# Altium project WUT-4-3-3.PrjPCB (part 2 of 2)

## Sheet MCU.SchDoc
size A3
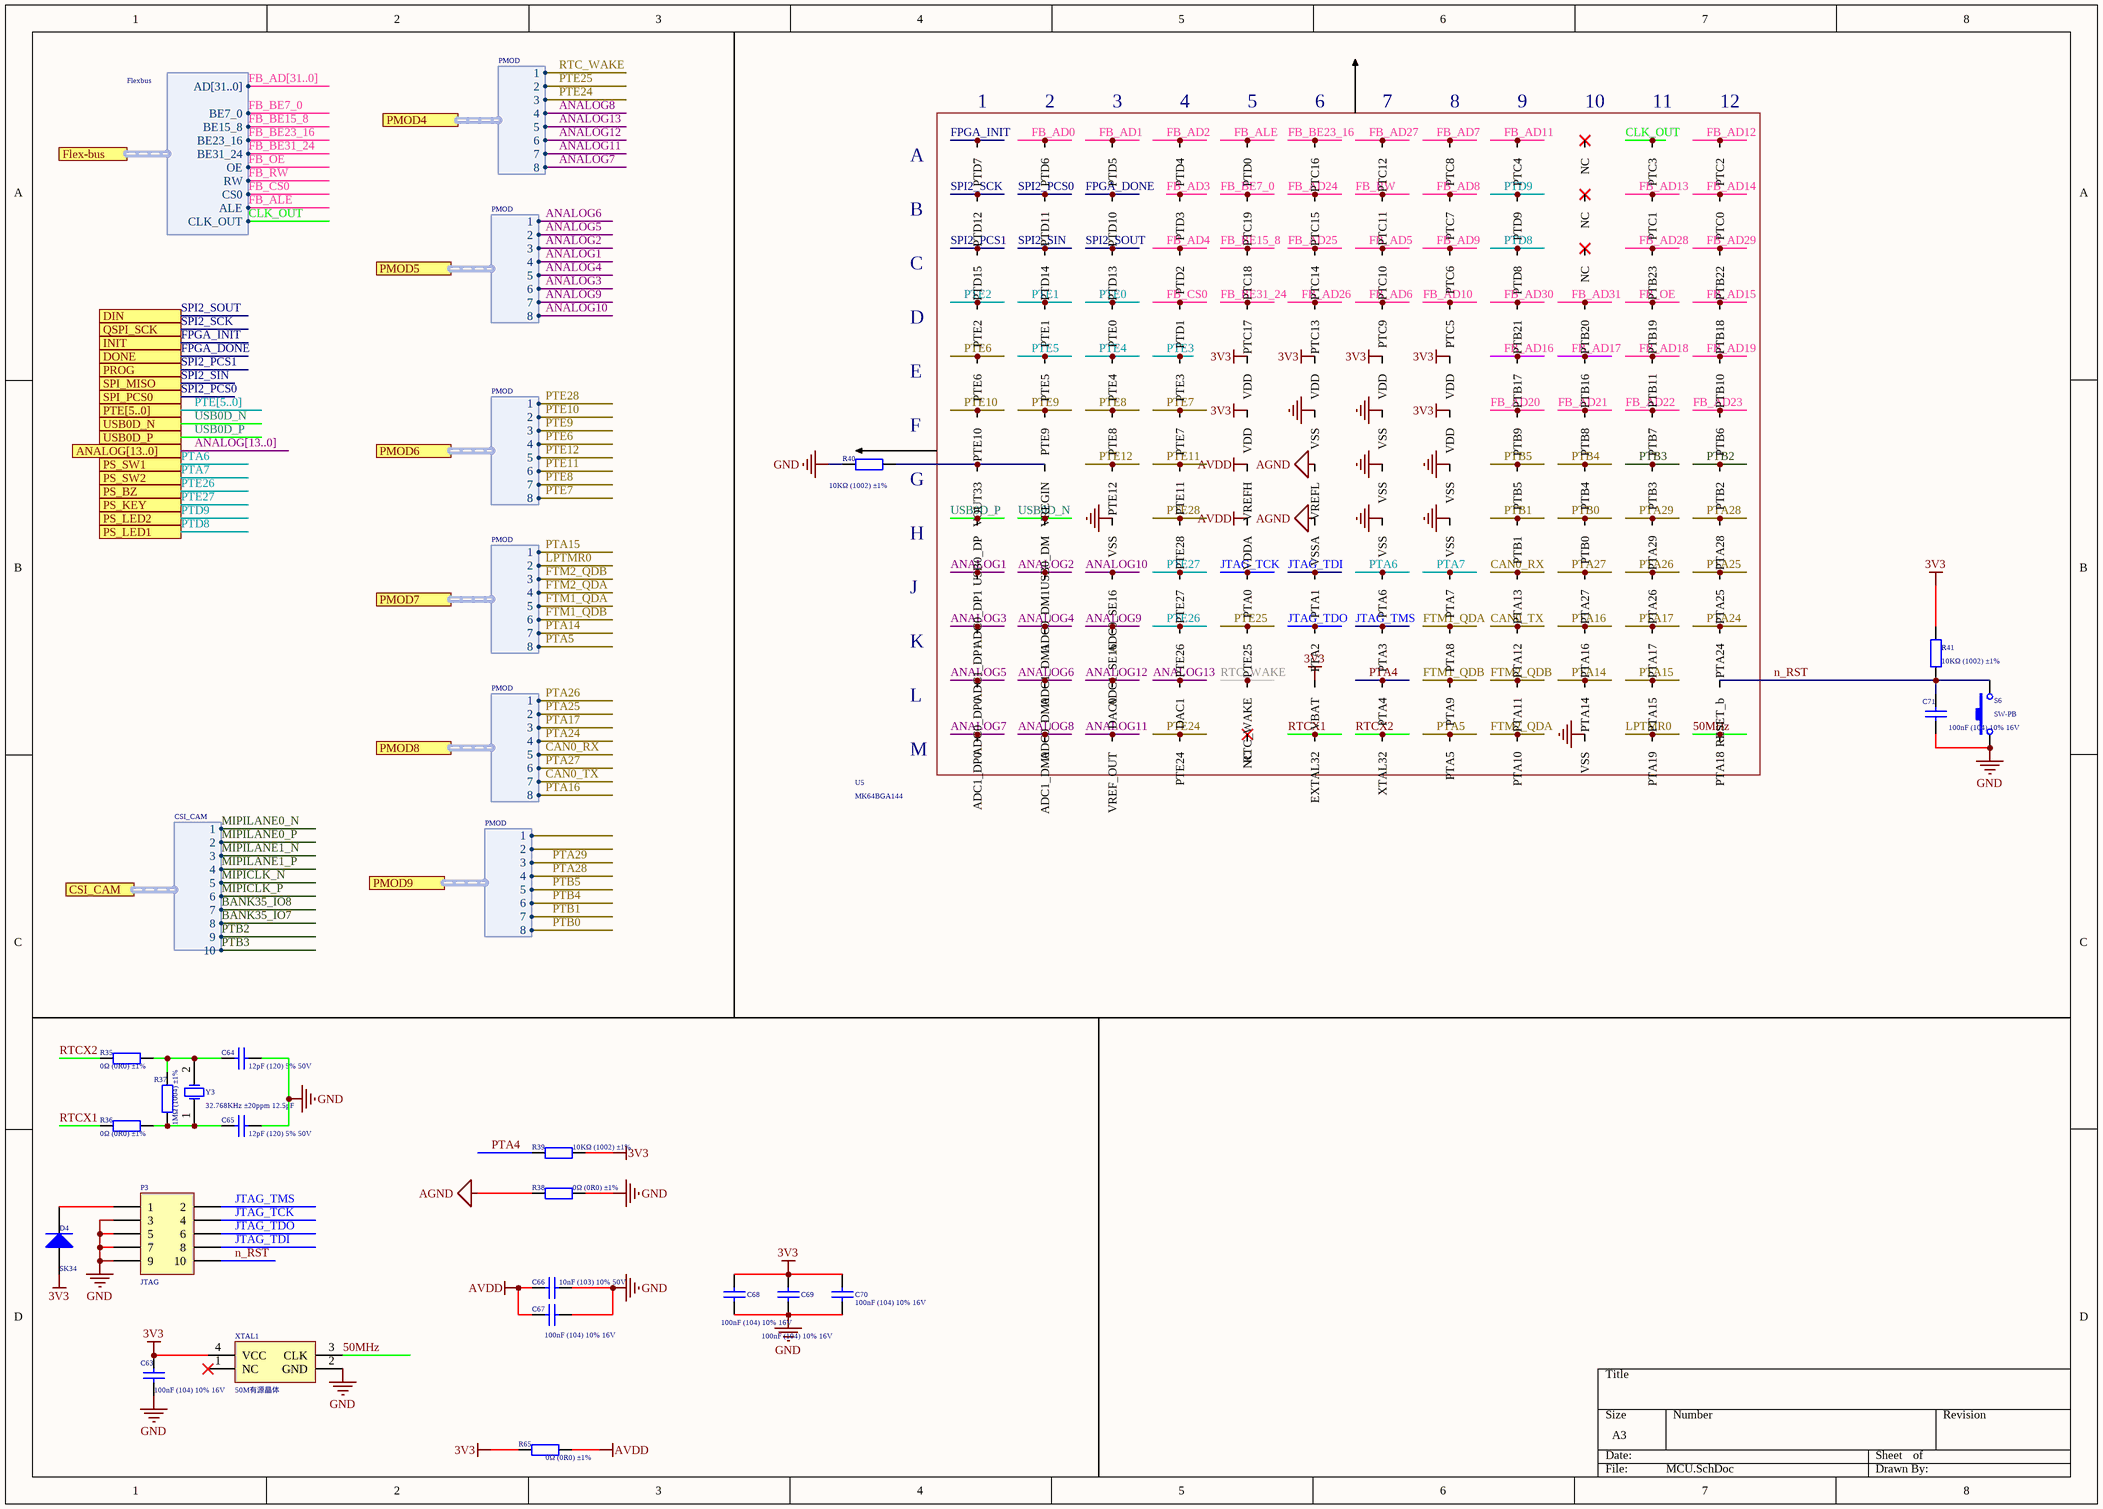
[diagram p7: MCU.SchDoc]

### Parts
C63  100nF (104) 10% 16V  [0402_C]
C64  12pF (120) 5% 50V  [0402_C]
C65  12pF (120) 5% 50V  [0402_C]
C66  10nF (103) 10% 50V  [0402_C]
C67  100nF (104) 10% 16V  [0402_C]
C68  100nF (104) 10% 16V  [0402_C]
C69  100nF (104) 10% 16V  [0402_C]
C70  100nF (104) 10% 16V  [0402_C]
C71  100nF (104) 10% 16V  [0402_C]
D4  SK34  [C2012]
P3  JTAG  [HDR2X5]
R35  0Ω (0R0) ±1%  [0402_R]
R36  0Ω (0R0) ±1%  [0402_R]
R37  1MΩ (1004) ±1%  [0402_R]
R38  0Ω (0R0) ±1%  [0402_R]
R39  10KΩ (1002) ±1%  [0402_R]
R40  10KΩ (1002) ±1%  [0402_R]
R41  10KΩ (1002) ±1%  [0402_R]
R65  0Ω (0R0) ±1%  [0402_R]
S6  SW-PB  [key 3*4*2]
U5  MK64BGA144  [BGA144C100P12X12_1300X1300X161]
XTAL1  50M有源晶体  [XTAL7_3225]
Y3  32.768KHz ±20ppm 12.5pF  [SMD-3215_2P FC - 135]

### Ports
ANALOG[13..0] (harness Flexbus), CSI_CAM (harness CSI_CAM), DIN, DONE, Flex-bus (harness Flexbus), INIT, PMOD4 (harness PMOD), PMOD5 (harness PMOD), PMOD6 (harness PMOD), PMOD7 (harness PMOD), PMOD8 (harness PMOD), PMOD9 (harness PMOD), PROG, PS_BZ, PS_KEY, PS_LED1, PS_LED2, PS_SW1, PS_SW2, PTE[5..0], QSPI_SCK, SPI_MISO, SPI_PCS0, USB0D_N, USB0D_P

### Harnesses
Flexbus: BE7_0, CS0, BE31_24, CLK_OUT, ALE, BE23_16, RW, BE15_8, OE, AD[31..0]
PMOD: 1, 2, 3, 4, 5, 6, 7, 8
CSI_CAM: 1, 2, 3, 4, 5, 6, 7, 8, 9, 10

### Nets
3V3: C63.2 C68.2 C69.2 C70.2 D4.1(A) R39.2 R41.2 R65.1 U5.E5(VDD) U5.E6(VDD) U5.E7(VDD) U5.E8(VDD) U5.F5(VDD) U5.F8(VDD) U5.L6(VBAT) XTAL1.4(VCC)
AGND: R38.1 U5.G6(VREFL) U5.H6(VSSA)
AVDD: C66.1 C67.1 R65.2 U5.G5(VREFH) U5.H5(VDDA)
GND: C63.1 C64.2 C65.2 C66.2 C67.2 C68.1 C69.1 C70.1 C71.1 P3.3 P3.5 P3.7 P3.9 R38.2 R40.1 S6.1 U5.F6(VSS) U5.F7(VSS) U5.G7(VSS) U5.G8(VSS) U5.H3(VSS) U5.H7(VSS) U5.H8(VSS) U5.M10(VSS) XTAL1.2(GND)
50MHz: U5.M12(PTA18) XTAL1.3(CLK)
ANALOG1: U5.J1(ADC0_DP1) ; port PMOD5.4
ANALOG2: U5.J2(ADC0_DM1) ; port PMOD5.3
ANALOG3: U5.K1(ADC1_DP1) ; port PMOD5.6
ANALOG4: U5.K2(ADC1_DM1) ; port PMOD5.5
ANALOG5: U5.L1(ADC0_DP0) ; port PMOD5.2
ANALOG6: U5.L2(ADC0_DM0) ; port PMOD5.1
ANALOG7: U5.M1(ADC1_DP0) ; port PMOD4.8
ANALOG8: U5.M2(ADC1_DM0) ; port PMOD4.4  [project net ANALOG13]
ANALOG9: U5.K3(ADC1_SE16) ; port PMOD5.7
ANALOG10: U5.J3(ADC0_SE16) ; port PMOD5.8
ANALOG11: U5.M3(VREF_OUT) ; port PMOD4.7
ANALOG12: U5.L3(DAC0) ; port PMOD4.6
ANALOG13: U5.L4(DAC1) ; port PMOD4.5
BANK35_IO7: port CSI_CAM.8
BANK35_IO8: port CSI_CAM.7
CAN0_RX: U5.J9(PTA13) ; port PMOD8.5
CAN0_TX: U5.K9(PTA12) ; port PMOD8.7
CLK_OUT: U5.A11(PTC3) ; port Flex-bus.CLK_OUT
FB_AD0: U5.A2(PTD6)
FB_AD1: U5.A3(PTD5)
FB_AD2: U5.A4(PTD4)
FB_AD3: U5.B4(PTD3)
FB_AD4: U5.C4(PTD2)
FB_AD5: U5.C7(PTC10)
FB_AD6: U5.D7(PTC9)
FB_AD7: U5.A8(PTC8)
FB_AD8: U5.B8(PTC7)
FB_AD9: U5.C8(PTC6)
FB_AD10: U5.D8(PTC5)
FB_AD11: U5.A9(PTC4)
FB_AD12: U5.A12(PTC2)
FB_AD13: U5.B11(PTC1)
FB_AD14: U5.B12(PTC0)
FB_AD15: U5.D12(PTB18)
FB_AD16: U5.E9(PTB17)
FB_AD17: U5.E10(PTB16)
FB_AD18: U5.E11(PTB11)
FB_AD19: U5.E12(PTB10)
FB_AD20: U5.F9(PTB9)
FB_AD21: U5.F10(PTB8)
FB_AD22: U5.F11(PTB7)
FB_AD23: U5.F12(PTB6)
FB_AD24: U5.B6(PTC15)
FB_AD25: U5.C6(PTC14)
FB_AD26: U5.D6(PTC13)
FB_AD27: U5.A7(PTC12)
FB_AD28: U5.C11(PTB23)
FB_AD29: U5.C12(PTB22)
FB_AD30: U5.D9(PTB21)
FB_AD31: U5.D10(PTB20)
FB_ALE: U5.A5(PTD0) ; port Flex-bus.ALE
FB_BE7_0: U5.B5(PTC19) ; port Flex-bus.BE7_0
FB_BE15_8: U5.C5(PTC18) ; port Flex-bus.BE15_8
FB_BE23_16: U5.A6(PTC16) ; port Flex-bus.BE23_16
FB_BE31_24: U5.D5(PTC17) ; port Flex-bus.BE31_24
FB_CS0: U5.D4(PTD1) ; port Flex-bus.CS0
FB_OE: U5.D11(PTB19) ; port Flex-bus.OE
FB_RW: U5.B7(PTC11) ; port Flex-bus.RW
FPGA_DONE: U5.B3(PTD10) ; port DONE  [project net DONE]
FPGA_INIT: U5.A1(PTD7) ; port INIT
FTM1_QDA: U5.K8(PTA8) ; port PMOD7.5
FTM1_QDB: U5.L8(PTA9) ; port PMOD7.6
FTM2_QDA: U5.M9(PTA10) ; port PMOD7.4
FTM2_QDB: U5.L9(PTA11) ; port PMOD7.3
JTAG_TCK: P3.4 U5.J5(PTA0)
JTAG_TDI: P3.8 U5.J6(PTA1)
JTAG_TDO: P3.6 U5.K6(PTA2)
JTAG_TMS: P3.2 U5.K7(PTA3)
LPTMR0: U5.M11(PTA19) ; port PMOD7.2
MIPICLK_N: port CSI_CAM.5
MIPICLK_P: port CSI_CAM.6
MIPILANE0_N: port CSI_CAM.1
MIPILANE0_P: port CSI_CAM.2
MIPILANE1_N: port CSI_CAM.3
MIPILANE1_P: port CSI_CAM.4
n_RST: C71.2 P3.10 R41.1 S6.2 U5.L12(RESET_b)
PTA4: R39.1 U5.L7(PTA4)
PTA5: U5.M8(PTA5) ; port PMOD7.8
PTA6: U5.J7(PTA6) ; port PS_SW1
PTA7: U5.J8(PTA7) ; port PS_SW2
PTA14: U5.L10(PTA14) ; port PMOD7.7
PTA15: U5.L11(PTA15) ; port PMOD7.1
PTA16: U5.K10(PTA16) ; port PMOD8.8
PTA17: U5.K11(PTA17) ; port PMOD8.3
PTA24: U5.K12(PTA24) ; port PMOD8.4
PTA25: U5.J12(PTA25) ; port PMOD8.2
PTA26: U5.J11(PTA26) ; port PMOD8.1
PTA27: U5.J10(PTA27) ; port PMOD8.6
PTA28: U5.H12(PTA28) ; port PMOD9.4
PTA29: U5.H11(PTA29) ; port PMOD9.3
PTB0: U5.H10(PTB0) ; port PMOD9.8
PTB1: U5.H9(PTB1) ; port PMOD9.7
PTB2: U5.G12(PTB2) ; port CSI_CAM.9
PTB3: U5.G11(PTB3) ; port CSI_CAM.10
PTB4: U5.G10(PTB4) ; port PMOD9.6
PTB5: U5.G9(PTB5) ; port PMOD9.5
PTD8: U5.C9(PTD8) ; port PS_LED1
PTD9: U5.B9(PTD9) ; port PS_LED2
PTE0: U5.D3(PTE0)
PTE1: U5.D2(PTE1)
PTE2: U5.D1(PTE2)
PTE3: U5.E4(PTE3)
PTE4: U5.E3(PTE4)
PTE5: U5.E2(PTE5)
PTE6: U5.E1(PTE6) ; port PMOD6.4
PTE7: U5.F4(PTE7) ; port PMOD6.8
PTE8: U5.F3(PTE8) ; port PMOD6.7
PTE9: U5.F2(PTE9) ; port PMOD6.3
PTE10: U5.F1(PTE10) ; port PMOD6.2
PTE11: U5.G4(PTE11) ; port PMOD6.6
PTE12: U5.G3(PTE12) ; port PMOD6.5
PTE24: U5.M4(PTE24) ; port PMOD4.3
PTE25: U5.K5(PTE25) ; port PMOD4.2
PTE26: U5.K4(PTE26) ; port PS_BZ
PTE27: U5.J4(PTE27) ; port PS_KEY
PTE28: U5.H4(PTE28) ; port PMOD6.1
RTC_WAKE: U5.L5(RTC_WAKE) ; port PMOD4.1  [project net PTE24]
RTCX1: R36.1 U5.M6(EXTAL32)
RTCX2: R35.1 U5.M7(XTAL32)
SPI2_PCS0: U5.B2(PTD11) ; port SPI_PCS0
SPI2_PCS1: U5.C1(PTD15) ; port PROG  [project net PROG]
SPI2_SCK: U5.B1(PTD12) ; port QSPI_SCK  [project net QSPI_SCK]
SPI2_SIN: U5.C2(PTD14) ; port SPI_MISO
SPI2_SOUT: U5.C3(PTD13) ; port DIN  [project net DIN]
USB0D_N: U5.H2(USB0_DM) ; port USB0D_N
USB0D_P: U5.H1(USB0_DP) ; port USB0D_P
NetC64_1: C64.1 R35.2 R37.2 Y3.2(OSC2)
NetC65_1: C65.1 R36.2 R37.1 Y3.1(OSC1)
NetD4_2: D4.2(K) P3.1
NetR40_2: R40.2 U5.G1(VOUT33) U5.G2(VREGIN)

Not connected (* = marked no-connect by the designer): U5 A10(NC)* B10(NC)* C10(NC)* M5(NC)*; XTAL1 1(NC)*

### Buses and harness runs
bus ANALOG[13..0]
bus FB_AD[31..0]
bus PTE[5..0] = port PTE[5..0]

### Notes on the sheet
- (in symbol MK64BGA144) 1; 2; 3; 4; 5; 6; 7; 8; 9; 10; 11; 12; A; B; C; D; E; F; G; H; J; K; L; M

### Library data of the parts
C63 C67-C71 = 0402 100nF (104) 10% 16V: 贴片电容; ComponentLink1Description: 供应商链接; ComponentLink1URL: http://www.szlcsc.com/product/details_1877.html; Package: 0402; Supplier: LC; SuppliersPartNumber: C1525
C64 C65 = 0402 12pF (120) 5% 50V: 贴片电容; ComponentLink1Description: 供应商链接; ComponentLink1URL: http://www.szlcsc.com/product/details_1899.html; Package: 0402; Supplier: LC; SuppliersPartNumber: C1547
C66 = 0402 10nF (103) 10% 50V: 贴片电容; ComponentLink1Description: 供应商链接; ComponentLink1URL: http://www.szlcsc.com/product/details_15869.html; Package: 0402; Supplier: LC; SuppliersPartNumber: C15195
D4 = Diode 1N4148: High Conductance Fast Diode; LatestRevisionDate: 17-Jul-2002; LatestRevisionNote: Re-released for DXP Platform.; DatasheetDocument: 1997; PackageReference: DO-35; Publisher: Altium Limited; Code_JEDEC: DO-204-AH; ComponentLink1Description: Manufacturer Link; ComponentLink2Description: Datasheet; ComponentLink2URL: http://www.fairchildsemi.com/ds/1N%2F1N4148.pdf
P3 = Header 5X2: Header, 5-Pin, Dual row; LatestRevisionDate: 17-Jul-2002; LatestRevisionNote: Re-released for DXP Platform.; Publisher: Altium Limited
R35 R36 R38 R65 = 0402 0Ω (0R0) 1%: 贴片电阻; ComponentLink1Description: 供应商链接; ComponentLink1URL: http://www.szlcsc.com/product/details_17853.html; Package: 0402; Supplier: LC; SuppliersPartNumber: C17168
R37 = 0402 1MΩ (1004) 1%: 贴片电阻; ComponentLink1Description: 供应商链接; ComponentLink1URL: http://www.szlcsc.com/product/details_26826.html; Package: 0402; Supplier: LC; SuppliersPartNumber: C26083
R39-R41 = 0402 10KΩ (1002) 1%: 贴片电阻; ComponentLink1Description: 供应商链接; ComponentLink1URL: http://www.szlcsc.com/product/details_26487.html; Package: 0402; Supplier: LC; SuppliersPartNumber: C25744
S6 = SW-PB: Switch
XTAL1 = 有源晶体
Y3 = SMD-3215_2P 32.768KHz 20ppm 12.5pF: 贴片晶振; ComponentLink1Description: 供应商链接; ComponentLink1URL: http://www.szlcsc.com/product/details_33310.html; Package: SMD-3215_2P; Supplier: LC; SuppliersPartNumber: C32346

## Nets that join several sheets
1V0: POWER (F3.1), FPGA_POWER (22 pins)
1V8: POWER (F2.1), FPGA_POWER (12 pins)
3V3: FPGA_IO (10 pins), POWER (F4.2), GENERAL-IO (48 pins), MEMORY (8 pins), FPGA_CONFIG (13 pins), FPGA_POWER (55 pins), MCU (16 pins)
5V0: POWER (12 pins), GENERAL-IO (F1.1)
GND: FPGA_IO (9 pins), POWER (26 pins), GENERAL-IO (71 pins), MEMORY (6 pins), FPGA_CONFIG (18 pins), FPGA_POWER (84 pins), MCU (25 pins)
XADCGND: FPGA_CONFIG (U1.H7 U1.H8 U1.J7 U1.J8), FPGA_POWER (C16.2 L6.2 U1.G7)
ANALOG13: GENERAL-IO (PMOD4.9), MCU (U5.M2)
BANK14_IO1: FPGA_IO (U1.K12), GENERAL-IO (S2.1)
BANK14_IO2: FPGA_IO (U1.L14), GENERAL-IO (LED1.3)
BANK14_IO3: FPGA_IO (U1.M14), GENERAL-IO (HAT1.5)
BANK14_IO4: FPGA_IO (U1.K13), GENERAL-IO (LED1.1)
BANK14_IO5: FPGA_IO (U1.L13), GENERAL-IO (LED1.4)
BANK14_IO6: FPGA_IO (U1.M12), GENERAL-IO (R24.1)
BANK14_IO7: FPGA_IO (U1.M16), GENERAL-IO (HAT1.3)
BANK14_IO8: FPGA_IO (U1.N16), GENERAL-IO (HAT1.7)
BANK14_IO9: FPGA_IO (U1.P15), GENERAL-IO (HAT1.12)
BANK14_IO10: FPGA_IO (U1.P16), GENERAL-IO (HAT1.11)
BANK14_IO11: FPGA_IO (U1.R15), GENERAL-IO (HAT1.15)
BANK14_IO12: FPGA_IO (U1.R16), GENERAL-IO (HAT1.13)
BANK14_IO13: FPGA_IO (U1.T14), GENERAL-IO (HAT1.18)
BANK14_IO14: FPGA_IO (U1.T15), GENERAL-IO (HAT1.16)
BANK14_IO15: FPGA_IO (U1.N13), GENERAL-IO (HAT1.10)
BANK14_IO16: FPGA_IO (U1.P13), GENERAL-IO (HAT1.21)
BANK14_IO17: FPGA_IO (U1.N14), GENERAL-IO (HAT1.8)
BANK14_IO18: FPGA_IO (U1.P14), GENERAL-IO (HAT1.19)
BANK14_IO19: FPGA_IO (U1.N12), GENERAL-IO (HAT1.27)
BANK14_IO20: FPGA_IO (U1.P10), GENERAL-IO (HAT1.31)
BANK14_IO21: FPGA_IO (U1.P11), GENERAL-IO (HAT1.28)
BANK14_IO22: FPGA_IO (U1.R12), GENERAL-IO (HAT1.24)
BANK14_IO23: FPGA_IO (U1.T12), GENERAL-IO (HAT1.26)
BANK14_IO24: FPGA_IO (U1.R13), GENERAL-IO (HAT1.23)
BANK14_IO25: FPGA_IO (U1.T13), GENERAL-IO (HAT1.22)
BANK14_IO26: FPGA_IO (U1.R10), GENERAL-IO (HAT1.33)
BANK14_IO27: FPGA_IO (U1.R11), GENERAL-IO (HAT1.29)
BANK14_IO28: FPGA_IO (U1.N9), GENERAL-IO (HAT1.37)
BANK14_IO29: FPGA_IO (U1.P9), GENERAL-IO (HAT1.36)
BANK14_IO30: FPGA_IO (U1.M6), GENERAL-IO (Rp1.5)
BANK14_IO32: FPGA_IO (U1.P8), GENERAL-IO (Rp2.8)
BANK14_IO33: FPGA_IO (U1.R8), GENERAL-IO (HAT1.40)
BANK14_IO34: FPGA_IO (U1.T7), GENERAL-IO (Rp2.7)
BANK14_IO35: FPGA_IO (U1.T8), GENERAL-IO (HAT1.38)
BANK14_IO36: FPGA_IO (U1.T9), GENERAL-IO (HAT1.35)
BANK14_IO37: FPGA_IO (U1.T10), GENERAL-IO (HAT1.32)
BANK14_IO38: FPGA_IO (U1.R5), GENERAL-IO (Rp1.7)
BANK14_IO39: FPGA_IO (U1.T5), GENERAL-IO (Rp1.6)
BANK14_IO40: FPGA_IO (U1.R6), GENERAL-IO (Rp2.5)
BANK14_IO41: FPGA_IO (U1.R7), GENERAL-IO (Rp2.6)
BANK14_IO42: FPGA_IO (U1.P6), GENERAL-IO (Rp1.8)
BANK34_IO1: FPGA_IO (U1.L5), GENERAL-IO (U6.2)
BANK34_IO2: FPGA_IO (U1.L4), GENERAL-IO (U6.1)
BANK34_IO3: FPGA_IO (U1.M4), GENERAL-IO (Rp4.5)
BANK34_IO4: FPGA_IO (U1.M2), GENERAL-IO (Rp5.6)
BANK34_IO5: FPGA_IO (U1.M1), GENERAL-IO (Rp5.5)
BANK34_IO6: FPGA_IO (U1.N3), GENERAL-IO (Rp6.5)
BANK34_IO7: FPGA_IO (U1.N2), GENERAL-IO (Rp5.8)
BANK34_IO8: FPGA_IO (U1.N1), GENERAL-IO (Rp5.7)
BANK34_IO9: FPGA_IO (U1.P1), GENERAL-IO (Rp6.6)
BANK34_IO10: FPGA_IO (U1.P4), GENERAL-IO (Rp4.6)
BANK34_IO11: FPGA_IO (U1.P3), GENERAL-IO (Rp6.7)
BANK34_IO12: FPGA_IO (U1.M5), GENERAL-IO (Rp4.7)
BANK34_IO13: FPGA_IO (U1.N4), GENERAL-IO (S4.1)
BANK34_IO14: FPGA_IO (U1.R2), GENERAL-IO (Rp3.5)
BANK34_IO15: FPGA_IO (U1.R1), GENERAL-IO (Rp6.8)
BANK34_IO16: FPGA_IO (U1.R3), GENERAL-IO (Rp3.7)
BANK34_IO17: FPGA_IO (U1.T2), GENERAL-IO (Rp3.6)
BANK34_IO18: FPGA_IO (U1.T4), GENERAL-IO (Rp4.8)
BANK34_IO19: FPGA_IO (U1.T3), GENERAL-IO (Rp3.8)
BANK34_IO20: FPGA_IO (U1.P5), GENERAL-IO (S4.2)
BANK35_IO7: FPGA_IO (U1.D6), GENERAL-IO (PCAM.12)
BANK35_IO8: FPGA_IO (U1.D5), GENERAL-IO (PCAM.11)
BANK35_IO9: FPGA_IO (U1.E5), GENERAL-IO (PMOD9.4 U7.1)
BANK35_IO10: FPGA_IO (U1.K5), GENERAL-IO (PMOD9.3 U7.2)
CLK_OUT: FPGA_IO (U1.D13), MCU (U5.A11)
DIN: FPGA_IO (R16.1 U1.J14), FPGA_CONFIG (MCU_CFG1.4), MCU (U5.C3)
DONE: FPGA_CONFIG (R8.1 R9.2 U1.H10), MCU (U5.B3)
FB_AD0: FPGA_IO (U1.J15), MCU (U5.A2)
FB_AD1: FPGA_IO (U1.J16), MCU (U5.A3)
FB_AD2: FPGA_IO (U1.H14), MCU (U5.A4)
FB_AD3: FPGA_IO (U1.H13), MCU (U5.B4)
FB_AD4: FPGA_IO (U1.E12), MCU (U5.C4)
FB_AD5: FPGA_IO (U1.B15), MCU (U5.C7)
FB_AD6: FPGA_IO (U1.C14), MCU (U5.D7)
FB_AD7: FPGA_IO (U1.E15), MCU (U5.A8)
FB_AD8: FPGA_IO (U1.E16), MCU (U5.B8)
FB_AD9: FPGA_IO (U1.A15), MCU (U5.C8)
FB_AD10: FPGA_IO (U1.B14), MCU (U5.D8)
FB_AD11: FPGA_IO (U1.E13), MCU (U5.A9)
FB_AD12: FPGA_IO (U1.C11), MCU (U5.A12)
FB_AD13: FPGA_IO (U1.B11), MCU (U5.B11)
FB_AD14: FPGA_IO (U1.D10), MCU (U5.B12)
FB_AD15: FPGA_IO (U1.B9), MCU (U5.D12)
FB_AD16: FPGA_IO (U1.A13), MCU (U5.E9)
FB_AD17: FPGA_IO (U1.C12), MCU (U5.E10)
FB_AD18: FPGA_IO (U1.A9), MCU (U5.E11)
FB_AD19: FPGA_IO (U1.D9), MCU (U5.E12)
FB_AD20: FPGA_IO (U1.B12), MCU (U5.F9)
FB_AD21: FPGA_IO (U1.A12), MCU (U5.F10)
FB_AD22: FPGA_IO (U1.C8), MCU (U5.F11)
FB_AD23: FPGA_IO (U1.A8), MCU (U5.F12)
FB_AD24: FPGA_IO (U1.G16), MCU (U5.B6)
FB_AD25: FPGA_IO (U1.C16), MCU (U5.C6)
FB_AD26: FPGA_IO (U1.B16), MCU (U5.D6)
FB_AD27: FPGA_IO (U1.F15), MCU (U5.A7)
FB_AD28: FPGA_IO (U1.B10), MCU (U5.C11)
FB_AD29: FPGA_IO (U1.A10), MCU (U5.C12)
FB_AD30: FPGA_IO (U1.A14), MCU (U5.D9)
FB_AD31: FPGA_IO (U1.C13), MCU (U5.D10)
FB_ALE: FPGA_IO (U1.G15), MCU (U5.A5)
FB_BE7_0: FPGA_IO (U1.H16), MCU (U5.B5)
FB_BE15_8: FPGA_IO (U1.D15), MCU (U5.C5)
FB_BE23_16: FPGA_IO (U1.G14), MCU (U5.A6)
FB_BE31_24: FPGA_IO (U1.D14), MCU (U5.D5)
FB_CS0: FPGA_IO (U1.D16), MCU (U5.D4)
FB_OE: FPGA_IO (U1.C9), MCU (U5.D11)
FB_RW: FPGA_IO (U1.F14), MCU (U5.B7)
FPGA_INIT: FPGA_CONFIG (R11.1 R12.2 U1.K10), MCU (U5.A1)
MIPICLK_N: FPGA_IO (U1.A7), GENERAL-IO (PCAM.8)
MIPICLK_P: FPGA_IO (U1.B7), GENERAL-IO (PCAM.9)
MIPILANE0_N: FPGA_IO (U1.B5), GENERAL-IO (PCAM.2)
MIPILANE0_P: FPGA_IO (U1.B6), GENERAL-IO (PCAM.3)
MIPILANE1_N: FPGA_IO (U1.C6), GENERAL-IO (PCAM.5)
MIPILANE1_P: FPGA_IO (U1.C7), GENERAL-IO (PCAM.6)
PROG: FPGA_CONFIG (JTAG1.14 R10.1 S1.2 U1.L9), MCU (U5.C1)
PTA6: GENERAL-IO (S5.2), MCU (U5.J7)
PTA7: GENERAL-IO (S5.1), MCU (U5.J8)
PTD8: GENERAL-IO (L3.1), MCU (U5.C9)
PTD9: GENERAL-IO (L4.1), MCU (U5.B9)
PTE24: GENERAL-IO (PMOD4.3), MCU (U5.M4)
PTE24: GENERAL-IO (PMOD4.5), MCU (U5.L5)
PTE25: GENERAL-IO (PMOD4.4), MCU (U5.K5)
PTE26: GENERAL-IO (R25.1), MCU (U5.K4)
PTE27: GENERAL-IO (S3.1), MCU (U5.J4)
QSPI_SCK: FPGA_IO (R20.2 U2.6), FPGA_CONFIG (MCU_CFG1.3 U1.E8), MCU (U5.B1)
SPI2_PCS0: FPGA_CONFIG (MCU_CFG1.2), MCU (U5.B2)
SPI2_SIN: FPGA_CONFIG (MCU_CFG1.1), MCU (U5.C2)
SRAM_CS: FPGA_IO (U1.J3), MEMORY (R42.2 U3.B5)
SRAM_OE: FPGA_IO (U1.G4), MEMORY (R44.2 U3.A2)
SRAM_WR: FPGA_IO (U1.C4), MEMORY (R43.2 U3.G5)
USB0D_N: GENERAL-IO (R26.2), MCU (U5.H2)
USB0D_P: GENERAL-IO (R27.2), MCU (U5.H1)